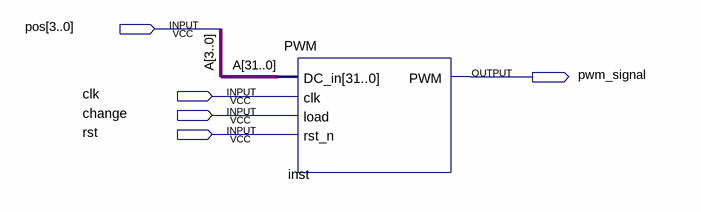
[diagram p0: schematic sheet]
// Quartus schematic ServoControl.bdf as structural Verilog: 1 symbols, 5 pins
module ServoControl (
  input  [3:0] pos,
  input  clk,
  input  change,
  input  rst,
  output pwm_signal
);

  wire [31:4] A;

  PWM inst (.DC_in({A, pos}), .clk(clk), .load(change), .rst_n(rst), .PWM(pwm_signal));

  // Other names for the same wires on the sheet: A[3:0] = pos
endmodule
